# Altium project S12642_0404_4.PrjPcb
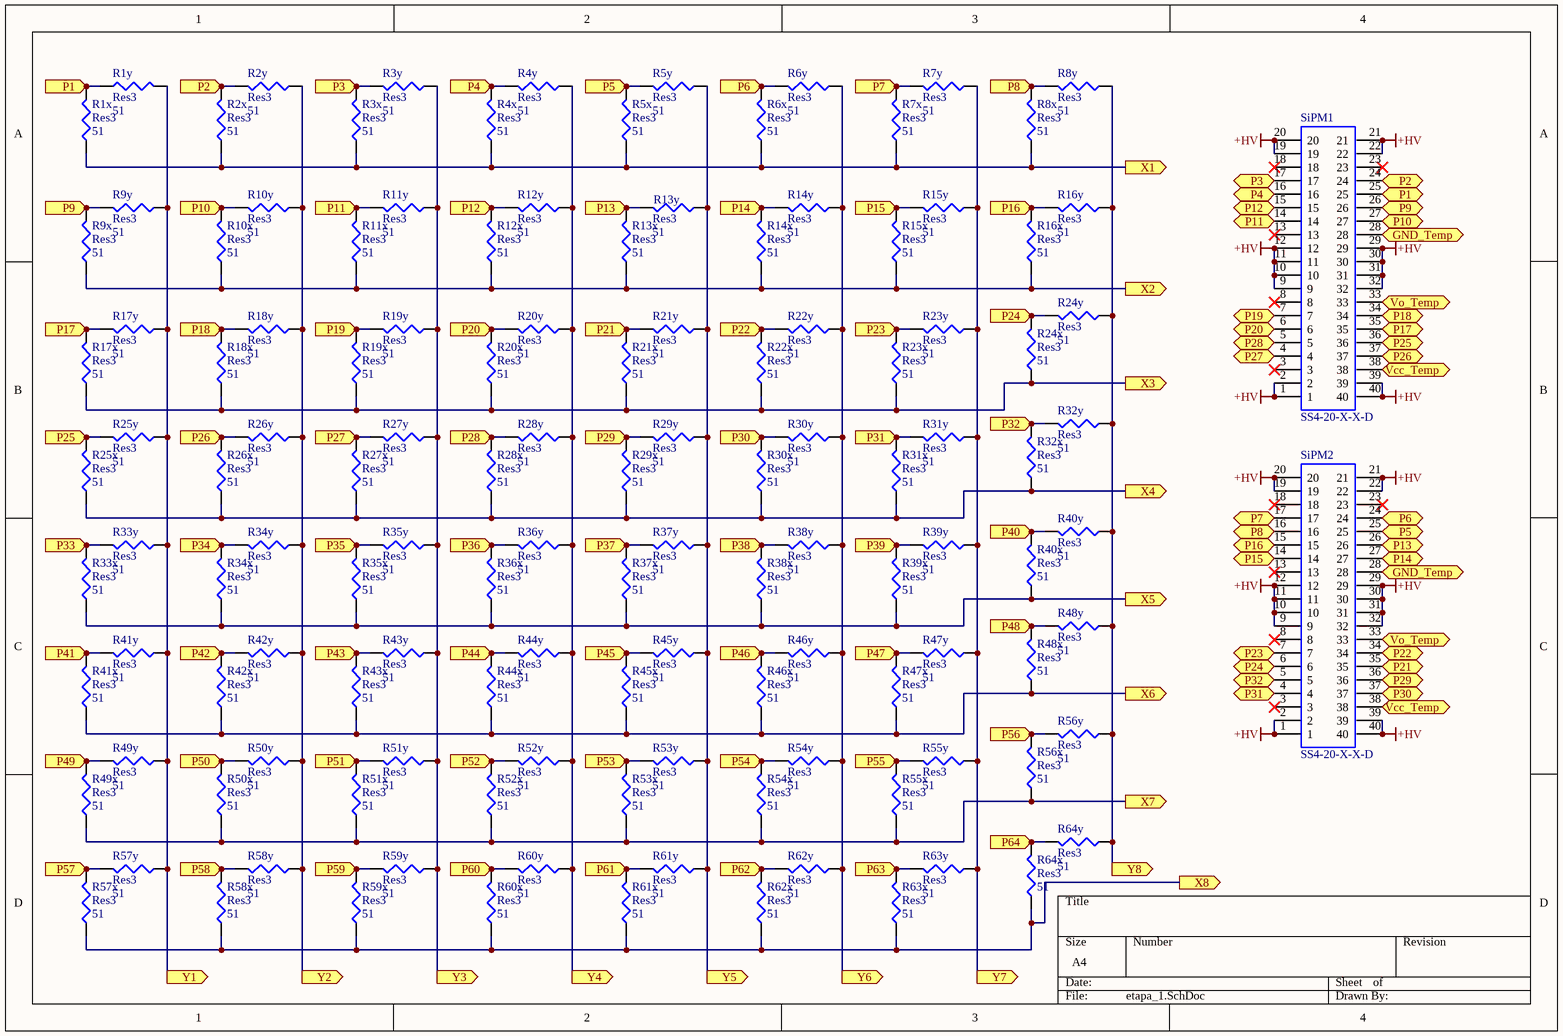
[diagram p0: etapa_1.SchDoc]
5 sheets, 421 parts. Net scope: flat (ports and power ports of the same name join across sheets).
Board file: etapa_1.PcbDoc
Sheets:
  etapa_1.SchDoc
  etapa_1_2.SchDoc
  etapa1_suma.SchDoc
  etapa1_anger_X.SchDoc
  etapa1_anger_Y.SchDoc

## Sheet etapa_1.SchDoc
size A4

### Parts
R1x  Res3  value 51  [0402]
R1y  Res3  value 51  [0402]
R2x  Res3  value 51  [0402]
R2y  Res3  value 51  [0402]
R3x  Res3  value 51  [0402]
R3y  Res3  value 51  [0402]
R4x  Res3  value 51  [0402]
R4y  Res3  value 51  [0402]
R5x  Res3  value 51  [0402]
R5y  Res3  value 51  [0402]
R6x  Res3  value 51  [0402]
R6y  Res3  value 51  [0402]
R7x  Res3  value 51  [0402]
R7y  Res3  value 51  [0402]
R8x  Res3  value 51  [0402]
R8y  Res3  value 51  [0402]
R9x  Res3  value 51  [0402]
R9y  Res3  value 51  [0402]
R10x  Res3  value 51  [0402]
R10y  Res3  value 51  [0402]
R11x  Res3  value 51  [0402]
R11y  Res3  value 51  [0402]
R12x  Res3  value 51  [0402]
R12y  Res3  value 51  [0402]
R13x  Res3  value 51  [0402]
R13y  Res3  value 51  [0402]
R14x  Res3  value 51  [0402]
R14y  Res3  value 51  [0402]
R15x  Res3  value 51  [0402]
R15y  Res3  value 51  [0402]
R16x  Res3  value 51  [0402]
R16y  Res3  value 51  [0402]
R17x  Res3  value 51  [0402]
R17y  Res3  value 51  [0402]
R18x  Res3  value 51  [0402]
R18y  Res3  value 51  [0402]
R19x  Res3  value 51  [0402]
R19y  Res3  value 51  [0402]
R20x  Res3  value 51  [0402]
R20y  Res3  value 51  [0402]
R21x  Res3  value 51  [0402]
R21y  Res3  value 51  [0402]
R22x  Res3  value 51  [0402]
R22y  Res3  value 51  [0402]
R23x  Res3  value 51  [0402]
R23y  Res3  value 51  [0402]
R24x  Res3  value 51  [0402]
R24y  Res3  value 51  [0402]
R25x  Res3  value 51  [0402]
R25y  Res3  value 51  [0402]
R26x  Res3  value 51  [0402]
R26y  Res3  value 51  [0402]
R27x  Res3  value 51  [0402]
R27y  Res3  value 51  [0402]
R28x  Res3  value 51  [0402]
R28y  Res3  value 51  [0402]
R29x  Res3  value 51  [0402]
R29y  Res3  value 51  [0402]
R30x  Res3  value 51  [0402]
R30y  Res3  value 51  [0402]
R31x  Res3  value 51  [0402]
R31y  Res3  value 51  [0402]
R32x  Res3  value 51  [0402]
R32y  Res3  value 51  [0402]
R33x  Res3  value 51  [0402]
R33y  Res3  value 51  [0402]
R34x  Res3  value 51  [0402]
R34y  Res3  value 51  [0402]
R35x  Res3  value 51  [0402]
R35y  Res3  value 51  [0402]
R36x  Res3  value 51  [0402]
R36y  Res3  value 51  [0402]
R37x  Res3  value 51  [0402]
R37y  Res3  value 51  [0402]
R38x  Res3  value 51  [0402]
R38y  Res3  value 51  [0402]
R39x  Res3  value 51  [0402]
R39y  Res3  value 51  [0402]
R40x  Res3  value 51  [0402]
R40y  Res3  value 51  [0402]
R41x  Res3  value 51  [0402]
R41y  Res3  value 51  [0402]
R42x  Res3  value 51  [0402]
R42y  Res3  value 51  [0402]
R43x  Res3  value 51  [0402]
R43y  Res3  value 51  [0402]
R44x  Res3  value 51  [0402]
R44y  Res3  value 51  [0402]
R45x  Res3  value 51  [0402]
R45y  Res3  value 51  [0402]
R46x  Res3  value 51  [0402]
R46y  Res3  value 51  [0402]
R47x  Res3  value 51  [0402]
R47y  Res3  value 51  [0402]
R48x  Res3  value 51  [0402]
R48y  Res3  value 51  [0402]
R49x  Res3  value 51  [0402]
R49y  Res3  value 51  [0402]
R50x  Res3  value 51  [0402]
R50y  Res3  value 51  [0402]
R51x  Res3  value 51  [0402]
R51y  Res3  value 51  [0402]
R52x  Res3  value 51  [0402]
R52y  Res3  value 51  [0402]
R53x  Res3  value 51  [0402]
R53y  Res3  value 51  [0402]
R54x  Res3  value 51  [0402]
R54y  Res3  value 51  [0402]
R55x  Res3  value 51  [0402]
R55y  Res3  value 51  [0402]
R56x  Res3  value 51  [0402]
R56y  Res3  value 51  [0402]
R57x  Res3  value 51  [0402]
R57y  Res3  value 51  [0402]
R58x  Res3  value 51  [0402]
R58y  Res3  value 51  [0402]
R59x  Res3  value 51  [0402]
R59y  Res3  value 51  [0402]
R60x  Res3  value 51  [0402]
R60y  Res3  value 51  [0402]
R61x  Res3  value 51  [0402]
R61y  Res3  value 51  [0402]
R62x  Res3  value 51  [0402]
R62y  Res3  value 51  [0402]
R63x  Res3  value 51  [0402]
R63y  Res3  value 51  [0402]
R64x  Res3  value 51  [0402]
R64y  Res3  value 51  [0402]
SiPM1  SS4-20-X-X-D  [SS4-20-X-X-D]
SiPM2  SS4-20-X-X-D  [SS4-20-X-X-D]

### Ports
GND_Temp (out), P1 (in), P1 (out), P2 (in), P2 (out), P3 (in), P3 (out), P4 (in), P4 (out), P5 (in), P5 (out), P6 (in), P6 (out), P7 (in), P7 (out), P8 (in), P8 (out), P9 (in), P9 (out), P10 (in), P10 (out), P11 (in), P11 (out), P12 (in), P12 (out), P13 (in), P13 (out), P14 (in), P14 (out), P15 (in), P15 (out), P16 (in), P16 (out), P17 (in), P17 (out), P18 (in), P18 (out), P19 (in), P19 (out), P20 (in), P20 (out), P21 (in), P21 (out), P22 (in), P22 (out), P23 (in), P23 (out), P24 (in), P24 (out), P25 (in), P25 (out), P26 (in), P26 (out), P27 (in), P27 (out), P28 (in), P28 (out), P29 (in), P29 (out), P30 (in), P30 (out), P31 (in), P31 (out), P32 (in), P32 (out), P33 (in), P34 (in), P35 (in), P36 (in), P37 (in), P38 (in), P39 (in), P40 (in), P41 (in), P42 (in), P43 (in), P44 (in), P45 (in), P46 (in), P47 (in), P48 (in), P49 (in), P50 (in), P51 (in), P52 (in), P53 (in), P54 (in), P55 (in), P56 (in), P57 (in), P58 (in), P59 (in), P60 (in), P61 (in), P62 (in), P63 (in), P64 (in), Vcc_Temp (out), Vo_Temp (out), X1 (out), X2 (out), X3 (out), X4 (out), X5 (out), X6 (out), X7 (out), X8 (out), Y1 (out), Y2 (out), Y3 (out), Y4 (out), Y5 (out), Y6 (out), Y7 (out), Y8 (out)

### Nets
+HV: SiPM1.1 SiPM1.2 SiPM1.9 SiPM1.10 SiPM1.11 SiPM1.12 SiPM1.19 SiPM1.20 SiPM1.21 SiPM1.22 SiPM1.29 SiPM1.30 SiPM1.31 SiPM1.32 SiPM1.39 SiPM1.40 SiPM2.1 SiPM2.2 SiPM2.9 SiPM2.10 SiPM2.11 SiPM2.12 SiPM2.19 SiPM2.20 SiPM2.21 SiPM2.22 SiPM2.29 SiPM2.30 SiPM2.31 SiPM2.32 SiPM2.39 SiPM2.40
NetR1n_2: R1x.2 R1y.1 SiPM1.25 ; port P1
NetR1x_1: R1x.1 R2x.1 R3x.1 R4x.1 R5x.1 R6x.1 R7x.1 R8x.1 ; port X1
NetR1y_2: R1y.2 R9y.1 R17y.1 R25y.1 R33y.1 R41y.1 R49y.1 R57y.1 ; port Y1
NetR2_1: R9x.1 R10x.1 R11x.1 R12x.1 R13x.1 R14x.1 R15x.1 R16x.1 ; port X2
NetR2n_2: R2x.2 R2y.2 SiPM1.24 ; port P2
NetR2y_1: R2y.1 R10y.1 R18y.1 R26y.1 R34y.1 R42y.1 R50y.1 R58y.1 ; port Y2
NetR3_1: R17x.1 R18x.1 R19x.1 R20x.1 R21x.1 R22x.1 R23x.1 R24x.1 ; port X3
NetR3n_2: R3x.2 R3y.2 SiPM1.17 ; port P3
NetR3y_1: R3y.1 R11y.1 R19y.1 R27y.1 R35y.1 R43y.1 R51y.1 R59y.1 ; port Y3
NetR4_1: R25x.1 R26x.1 R27x.1 R28x.1 R29x.1 R30x.1 R31x.1 R32x.1 ; port X4
NetR4n_2: R4x.2 R4y.2 SiPM1.16 ; port P4
NetR4y_1: R4y.1 R12y.1 R20y.1 R28y.1 R36y.1 R44y.1 R52y.1 R60y.1 ; port Y4
NetR5_1: R33x.1 R34x.1 R35x.1 R36x.1 R37x.1 R38x.1 R39x.1 R40x.1 ; port X5
NetR5n_2: R5x.2 R5y.2 SiPM2.25 ; port P5
NetR5y_1: R5y.1 R13y.1 R21y.1 R29y.1 R37y.1 R45y.1 R53y.1 R61y.1 ; port Y5
NetR6_1: R41x.1 R42x.1 R43x.1 R44x.1 R45x.1 R46x.1 R47x.1 R48x.1 ; port X6
NetR6n_2: R6x.2 R6y.2 SiPM2.24 ; port P6
NetR6y_1: R6y.1 R14y.1 R22y.1 R30y.1 R38y.1 R46y.1 R54y.1 R62y.1 ; port Y6
NetR7_1: R49x.1 R50x.1 R51x.1 R52x.1 R53x.1 R54x.1 R55x.1 R56x.1 ; port X7
NetR7n_2: R7x.2 R7y.2 SiPM2.17 ; port P7
NetR7y_1: R7y.1 R15y.1 R23y.1 R31y.1 R39y.1 R47y.1 R55y.1 R63y.1 ; port Y7
NetR8_1: R57x.1 R58x.1 R59x.1 R60x.1 R61x.1 R62x.1 R63x.1 R64x.1 ; port X8
NetR8n_2: R8x.2 R8y.2 SiPM2.16 ; port P8
NetR8y_1: R8y.1 R16y.1 R24y.1 R32y.1 R40y.1 R48y.1 R56y.1 R64y.1 ; port Y8
NetR9n_2: R9x.2 R9y.2 SiPM1.26 ; port P9
NetR10n_2: R10x.2 R10y.2 SiPM1.27 ; port P10
NetR11n_2: R11x.2 R11y.2 SiPM1.14 ; port P11
NetR12n_2: R12x.2 R12y.2 SiPM1.15 ; port P12
NetR13n_2: R13x.2 R13y.2 SiPM2.26 ; port P13
NetR14n_2: R14x.2 R14y.2 SiPM2.27 ; port P14
NetR15n_2: R15x.2 R15y.2 SiPM2.14 ; port P15
NetR16n_2: R16x.2 R16y.2 SiPM2.15 ; port P16
NetR17n_2: R17x.2 R17y.2 SiPM1.35 ; port P17
NetR18n_2: R18x.2 R18y.2 SiPM1.34 ; port P18
NetR19n_2: R19x.2 R19y.2 SiPM1.7 ; port P19
NetR20n_2: R20x.2 R20y.2 SiPM1.6 ; port P20
NetR21n_2: R21x.2 R21y.2 SiPM2.35 ; port P21
NetR22n_2: R22x.2 R22y.2 SiPM2.34 ; port P22
NetR23n_2: R23x.2 R23y.2 SiPM2.7 ; port P23
NetR24n_2: R24x.2 R24y.2 SiPM2.6 ; port P24
NetR25n_2: R25x.2 R25y.2 SiPM1.36 ; port P25
NetR26n_2: R26x.2 R26y.2 SiPM1.37 ; port P26
NetR27n_2: R27x.2 R27y.2 SiPM1.4 ; port P27
NetR28n_2: R28x.2 R28y.2 SiPM1.5 ; port P28
NetR29n_2: R29x.2 R29y.2 SiPM2.36 ; port P29
NetR30n_2: R30x.2 R30y.2 SiPM2.37 ; port P30
NetR31n_2: R31x.2 R31y.2 SiPM2.4 ; port P31
NetR32n_2: R32x.2 R32y.2 SiPM2.5 ; port P32
NetR33n_2: R33x.2 R33y.2 ; port P33
NetR34n_2: R34x.2 R34y.2 ; port P34
NetR35n_2: R35x.2 R35y.2 ; port P35
NetR36n_2: R36x.2 R36y.2 ; port P36
NetR37n_2: R37x.2 R37y.2 ; port P37
NetR38n_2: R38x.2 R38y.2 ; port P38
NetR39n_2: R39x.2 R39y.2 ; port P39
NetR40n_2: R40x.2 R40y.2 ; port P40
NetR41n_2: R41x.2 R41y.2 ; port P41
NetR42n_2: R42x.2 R42y.2 ; port P42
NetR43n_2: R43x.2 R43y.2 ; port P43
NetR44n_2: R44x.2 R44y.2 ; port P44
NetR45n_2: R45x.2 R45y.2 ; port P45
NetR46n_2: R46x.2 R46y.2 ; port P46
NetR47n_2: R47x.2 R47y.2 ; port P47
NetR48n_2: R48x.2 R48y.2 ; port P48
NetR49n_2: R49x.2 R49y.2 ; port P49
NetR50n_2: R50x.2 R50y.2 ; port P50
NetR51n_2: R51x.2 R51y.2 ; port P51
NetR52n_2: R52x.2 R52y.2 ; port P52
NetR53n_2: R53x.2 R53y.2 ; port P53
NetR54n_2: R54x.2 R54y.2 ; port P54
NetR55n_2: R55x.2 R55y.2 ; port P55
NetR56n_2: R56x.2 R56y.2 ; port P56
NetR57n_2: R57x.2 R57y.2 ; port P57
NetR58n_2: R58x.2 R58y.2 ; port P58
NetR59n_2: R59x.2 R59y.2 ; port P59
NetR60n_2: R60x.2 R60y.2 ; port P60
NetR61n_2: R61x.2 R61y.2 ; port P61
NetR62n_2: R62x.2 R62y.2 ; port P62
NetR63n_2: R63x.2 R63y.2 ; port P63
NetR64n_2: R64x.2 R64y.2 ; port P64
NetSiPM1_28: SiPM1.28 SiPM2.28 ; port GND_Temp
NetSiPM1_33: SiPM1.33 SiPM2.33 ; port Vo_Temp
NetSiPM1_38: SiPM1.38 SiPM2.38 ; port Vcc_Temp

Not connected (* = marked no-connect by the designer): SiPM1 3* 8* 13* 18* 23*; SiPM2 3* 8* 13* 18* 23*

### Library data of the parts
R1x R1y R2x R2y R3x R3y R4x R4y R5x R5y R6x R6y R7x R7y R8x R8y R9x R9y R10x R10y R11x R11y R12x R12y R13x R13y R14x R14y R15x R15y R16x R16y R17x R17y R18x R18y R19x R19y R20x R20y R21x R21y R22x R22y R23x R23y R24x R24y R25x R25y R26x R26y R27x R27y R28x R28y R29x R29y R30x R30y R31x R31y R32x R32y R33x R33y R34x R34y R35x R35y R36x R36y R37x R37y R38x R38y R39x R39y R40x R40y R41x R41y R42x R42y R43x R43y R44x R44y R45x R45y R46x R46y R47x R47y R48x R48y R49x R49y R50x R50y R51x R51y R52x R52y R53x R53y R54x R54y R55x R55y R56x R56y R57x R57y R58x R58y R59x R59y R60x R60y R61x R61y R62x R62y R63x R63y R64x R64y = Res3: Resistor; Published: 8-Jun-2000; LatestRevisionDate: 29-May-2009; LatestRevisionNote: IPC-7351 Footprint Added.; PackageReference: J1-0603; Publisher: Altium Limited; PackageDescription: Chip Resistor

## Sheet etapa_1_2.SchDoc
size A4
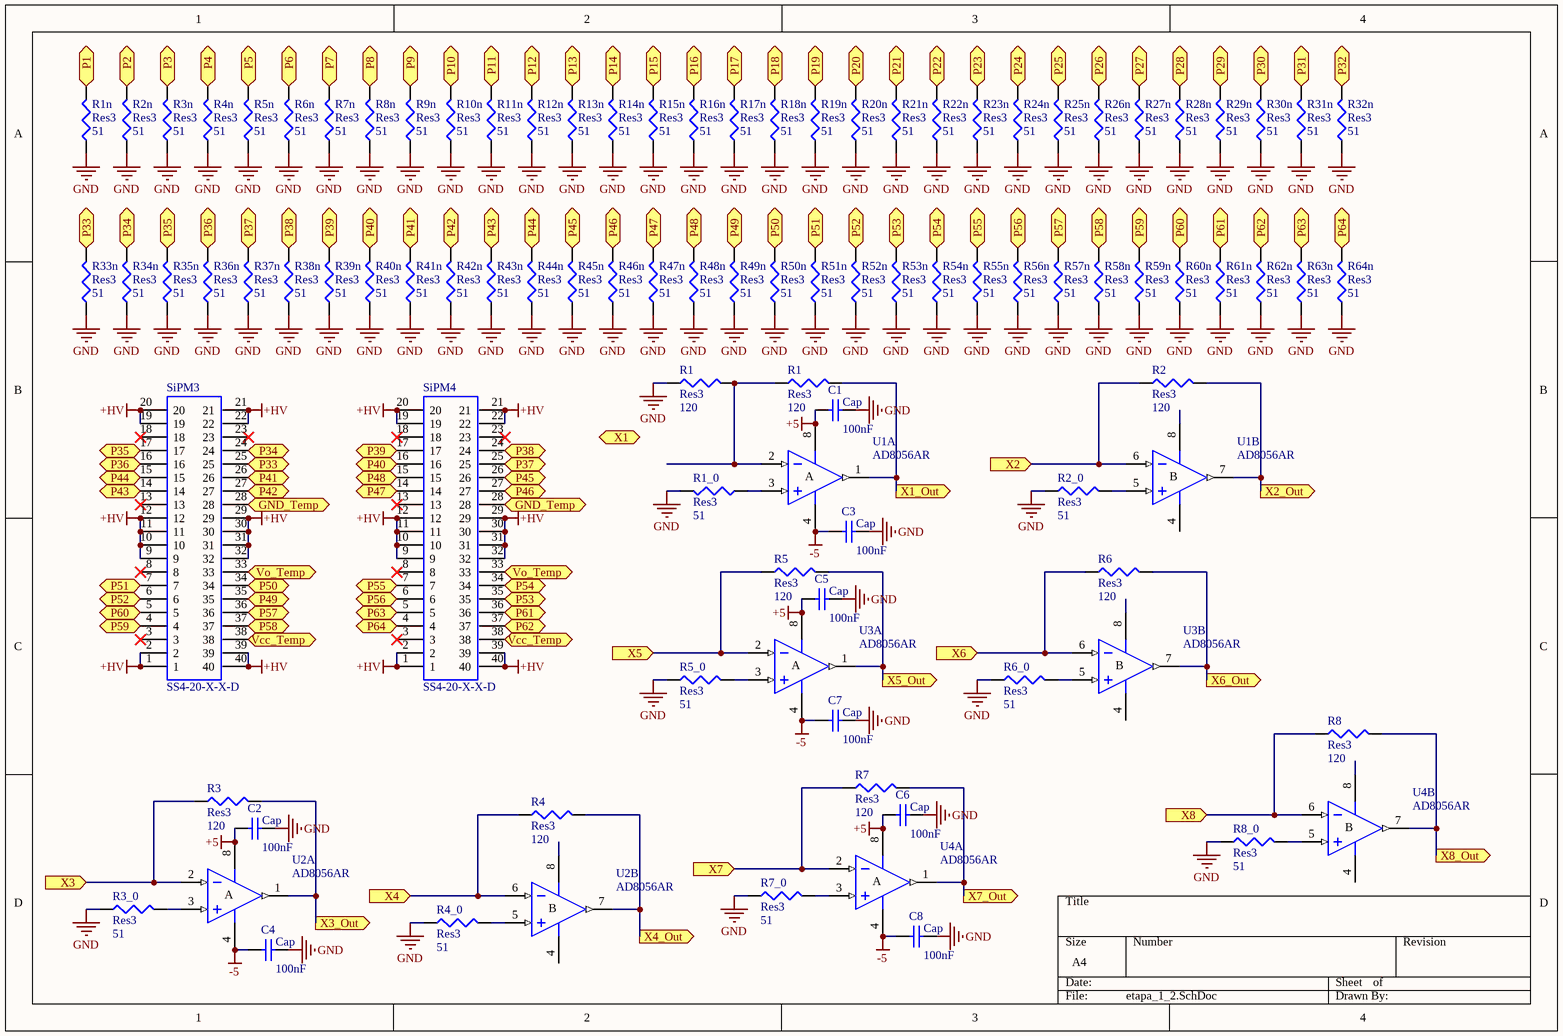
[diagram p1: etapa_1_2.SchDoc]

### Parts
(Parts that share a designator on the sheet are numbered #1, #2 ... from top to bottom, then left to right.)
C1  Cap  value 100nF  [1608[0603]]
C2  Cap  value 100nF  [1608[0603]]
C3  Cap  value 100nF  [1608[0603]]
C4  Cap  value 100nF  [1608[0603]]
C5  Cap  value 100nF  [1608[0603]]
C6  Cap  value 100nF  [1608[0603]]
C7  Cap  value 100nF  [1608[0603]]
C8  Cap  value 100nF  [1608[0603]]
R1#1  Res3  value 120  [0402]
R1#2  Res3  value 120  [0402]
R1_0  Res3  value 51  [0402]
R1n  Res3  value 51  [0402]
R2  Res3  value 120  [0402]
R2_0  Res3  value 51  [0402]
R2n  Res3  value 51  [0402]
R3  Res3  value 120  [0402]
R3_0  Res3  value 51  [0402]
R3n  Res3  value 51  [0402]
R4  Res3  value 120  [0402]
R4_0  Res3  value 51  [0402]
R4n  Res3  value 51  [0402]
R5  Res3  value 120  [0402]
R5_0  Res3  value 51  [0402]
R5n  Res3  value 51  [0402]
R6  Res3  value 120  [0402]
R6_0  Res3  value 51  [0402]
R6n  Res3  value 51  [0402]
R7  Res3  value 120  [0402]
R7_0  Res3  value 51  [0402]
R7n  Res3  value 51  [0402]
R8  Res3  value 120  [0402]
R8_0  Res3  value 51  [0402]
R8n  Res3  value 51  [0402]
R9n  Res3  value 51  [0402]
R10n  Res3  value 51  [0402]
R11n  Res3  value 51  [0402]
R12n  Res3  value 51  [0402]
R13n  Res3  value 51  [0402]
R14n  Res3  value 51  [0402]
R15n  Res3  value 51  [0402]
R16n  Res3  value 51  [0402]
R17n  Res3  value 51  [0402]
R18n  Res3  value 51  [0402]
R19n  Res3  value 51  [0402]
R20n  Res3  value 51  [0402]
R21n  Res3  value 51  [0402]
R22n  Res3  value 51  [0402]
R23n  Res3  value 51  [0402]
R24n  Res3  value 51  [0402]
R25n  Res3  value 51  [0402]
R26n  Res3  value 51  [0402]
R27n  Res3  value 51  [0402]
R28n  Res3  value 51  [0402]
R29n  Res3  value 51  [0402]
R30n  Res3  value 51  [0402]
R31n  Res3  value 51  [0402]
R32n  Res3  value 51  [0402]
R33n  Res3  value 51  [0402]
R34n  Res3  value 51  [0402]
R35n  Res3  value 51  [0402]
R36n  Res3  value 51  [0402]
R37n  Res3  value 51  [0402]
R38n  Res3  value 51  [0402]
R39n  Res3  value 51  [0402]
R40n  Res3  value 51  [0402]
R41n  Res3  value 51  [0402]
R42n  Res3  value 51  [0402]
R43n  Res3  value 51  [0402]
R44n  Res3  value 51  [0402]
R45n  Res3  value 51  [0402]
R46n  Res3  value 51  [0402]
R47n  Res3  value 51  [0402]
R48n  Res3  value 51  [0402]
R49n  Res3  value 51  [0402]
R50n  Res3  value 51  [0402]
R51n  Res3  value 51  [0402]
R52n  Res3  value 51  [0402]
R53n  Res3  value 51  [0402]
R54n  Res3  value 51  [0402]
R55n  Res3  value 51  [0402]
R56n  Res3  value 51  [0402]
R57n  Res3  value 51  [0402]
R58n  Res3  value 51  [0402]
R59n  Res3  value 51  [0402]
R60n  Res3  value 51  [0402]
R61n  Res3  value 51  [0402]
R62n  Res3  value 51  [0402]
R63n  Res3  value 51  [0402]
R64n  Res3  value 51  [0402]
SiPM3  SS4-20-X-X-D  [SS4-20-X-X-D]
SiPM4  SS4-20-X-X-D  [SS4-20-X-X-D]
U1  AD8056AR  [RM-8]  (parts A,B of 2)
U2  AD8056AR  [RM-8]  (parts A,B of 2)
U3  AD8056AR  [RM-8]  (parts A,B of 2)
U4  AD8056AR  [RM-8]  (parts A,B of 2)

### Ports
GND_Temp (out), P1 (in), P2 (in), P3 (in), P4 (in), P5 (in), P6 (in), P7 (in), P8 (in), P9 (in), P10 (in), P11 (in), P12 (in), P13 (in), P14 (in), P15 (in), P16 (in), P17 (in), P18 (in), P19 (in), P20 (in), P21 (in), P22 (in), P23 (in), P24 (in), P25 (in), P26 (in), P27 (in), P28 (in), P29 (in), P30 (in), P31 (in), P32 (in), P33 (in), P33 (out), P34 (in), P34 (out), P35 (in), P35 (out), P36 (in), P36 (out), P37 (in), P37 (out), P38 (in), P38 (out), P39 (in), P39 (out), P40 (in), P40 (out), P41 (in), P41 (out), P42 (in), P42 (out), P43 (in), P43 (out), P44 (in), P44 (out), P45 (in), P45 (out), P46 (in), P46 (out), P47 (in), P47 (out), P48 (in), P48 (out), P49 (in), P49 (out), P50 (in), P50 (out), P51 (in), P51 (out), P52 (in), P52 (out), P53 (in), P53 (out), P54 (in), P54 (out), P55 (in), P55 (out), P56 (in), P56 (out), P57 (in), P57 (out), P58 (in), P58 (out), P59 (in), P59 (out), P60 (in), P60 (out), P61 (in), P61 (out), P62 (in), P62 (out), P63 (in), P63 (out), P64 (in), P64 (out), Vcc_Temp (out), Vo_Temp (out), X1 (in), X1_Out (out), X2 (in), X2_Out (out), X3 (in), X3_Out (out), X4 (in), X4_Out (out), X5 (in), X5_Out (out), X6 (in), X6_Out (out), X7 (in), X7_Out (out), X8 (in), X8_Out (out)

### Nets
+5: C1.2 C2.2 C5.2 C6.2 U1.8(V+) U2.8(V+) U3.8(V+) U4.8(V+)
+HV: SiPM3.1 SiPM3.2 SiPM3.9 SiPM3.10 SiPM3.11 SiPM3.12 SiPM3.19 SiPM3.20 SiPM3.21 SiPM3.22 SiPM3.29 SiPM3.30 SiPM3.31 SiPM3.32 SiPM3.39 SiPM3.40 SiPM4.1 SiPM4.2 SiPM4.9 SiPM4.10 SiPM4.11 SiPM4.12 SiPM4.19 SiPM4.20 SiPM4.21 SiPM4.22 SiPM4.29 SiPM4.30 SiPM4.31 SiPM4.32 SiPM4.39 SiPM4.40
-5: C3.2 C4.2 C7.2 C8.2 U1.4(V-) U2.4(V-) U3.4(V-) U4.4(V-)
GND: C1.1 C2.1 C3.1 C4.1 C5.1 C6.1 C7.1 C8.1 R1#1.1 R1_0.2 R1n.1 R2_0.1 R2n.1 R3_0.1 R3n.1 R4_0.1 R4n.1 R5_0.1 R5n.1 R6_0.1 R6n.1 R7_0.1 R7n.1 R8_0.1 R8n.1 R9n.1 R10n.1 R11n.1 R12n.1 R13n.1 R14n.1 R15n.1 R16n.1 R17n.1 R18n.1 R19n.1 R20n.1 R21n.1 R22n.1 R23n.1 R24n.1 R25n.1 R26n.1 R27n.1 R28n.1 R29n.1 R30n.1 R31n.1 R32n.1 R33n.1 R34n.1 R35n.1 R36n.1 R37n.1 R38n.1 R39n.1 R40n.1 R41n.1 R42n.1 R43n.1 R44n.1 R45n.1 R46n.1 R47n.1 R48n.1 R49n.1 R50n.1 R51n.1 R52n.1 R53n.1 R54n.1 R55n.1 R56n.1 R57n.1 R58n.1 R59n.1 R60n.1 R61n.1 R62n.1 R63n.1 R64n.1
NetC1x_1: R1#2.2 U1.1(OUT) ; port X1_Out
NetC2x_1: R2.2 U1.7(OUT) ; port X2_Out
NetC3x_1: R3.2 U2.1(OUT) ; port X3_Out
NetC4x_1: R4.2 U2.7(OUT) ; port X4_Out
NetC5x_1: R5.2 U3.1(OUT) ; port X5_Out
NetC6x_1: R6.2 U3.7(OUT) ; port X6_Out
NetC7x_1: R7.2 U4.1(OUT) ; port X7_Out
NetC8x_1: R8.2 U4.7(OUT) ; port X8_Out
NetR1#1_2: R1#1.2 R1#2.1 U1.2(IN-)
NetR1_0_1: R1_0.1 U1.3(IN+)
NetR1n_2: R1n.2 ; port P1
NetR2_0_2: R2_0.2 U1.5(IN+)
NetR2_1: R2.1 U1.6(IN-) ; port X2
NetR2n_2: R2n.2 ; port P2
NetR3_0_2: R3_0.2 U2.3(IN+)
NetR3_1: R3.1 U2.2(IN-) ; port X3
NetR3n_2: R3n.2 ; port P3
NetR4_0_2: R4_0.2 U2.5(IN+)
NetR4_1: R4.1 U2.6(IN-) ; port X4
NetR4n_2: R4n.2 ; port P4
NetR5_0_2: R5_0.2 U3.3(IN+)
NetR5_1: R5.1 U3.2(IN-) ; port X5
NetR5n_2: R5n.2 ; port P5
NetR6_0_2: R6_0.2 U3.5(IN+)
NetR6_1: R6.1 U3.6(IN-) ; port X6
NetR6n_2: R6n.2 ; port P6
NetR7_0_2: R7_0.2 U4.3(IN+)
NetR7_1: R7.1 U4.2(IN-) ; port X7
NetR7n_2: R7n.2 ; port P7
NetR8_0_2: R8_0.2 U4.5(IN+)
NetR8_1: R8.1 U4.6(IN-) ; port X8
NetR8n_2: R8n.2 ; port P8
NetR9n_2: R9n.2 ; port P9
NetR10n_2: R10n.2 ; port P10
NetR11n_2: R11n.2 ; port P11
NetR12n_2: R12n.2 ; port P12
NetR13n_2: R13n.2 ; port P13
NetR14n_2: R14n.2 ; port P14
NetR15n_2: R15n.2 ; port P15
NetR16n_2: R16n.2 ; port P16
NetR17n_2: R17n.2 ; port P17
NetR18n_2: R18n.2 ; port P18
NetR19n_2: R19n.2 ; port P19
NetR20n_2: R20n.2 ; port P20
NetR21n_2: R21n.2 ; port P21
NetR22n_2: R22n.2 ; port P22
NetR23n_2: R23n.2 ; port P23
NetR24n_2: R24n.2 ; port P24
NetR25n_2: R25n.2 ; port P25
NetR26n_2: R26n.2 ; port P26
NetR27n_2: R27n.2 ; port P27
NetR28n_2: R28n.2 ; port P28
NetR29n_2: R29n.2 ; port P29
NetR30n_2: R30n.2 ; port P30
NetR31n_2: R31n.2 ; port P31
NetR32n_2: R32n.2 ; port P32
NetR33n_2: R33n.2 SiPM3.25 ; port P33
NetR34n_2: R34n.2 SiPM3.24 ; port P34
NetR35n_2: R35n.2 SiPM3.17 ; port P35
NetR36n_2: R36n.2 SiPM3.16 ; port P36
NetR37n_2: R37n.2 SiPM4.25 ; port P37
NetR38n_2: R38n.2 SiPM4.24 ; port P38
NetR39n_2: R39n.2 SiPM4.17 ; port P39
NetR40n_2: R40n.2 SiPM4.16 ; port P40
NetR41n_2: R41n.2 SiPM3.26 ; port P41
NetR42n_2: R42n.2 SiPM3.27 ; port P42
NetR43n_2: R43n.2 SiPM3.14 ; port P43
NetR44n_2: R44n.2 SiPM3.15 ; port P44
NetR45n_2: R45n.2 SiPM4.26 ; port P45
NetR46n_2: R46n.2 SiPM4.27 ; port P46
NetR47n_2: R47n.2 SiPM4.14 ; port P47
NetR48n_2: R48n.2 SiPM4.15 ; port P48
NetR49n_2: R49n.2 SiPM3.35 ; port P49
NetR50n_2: R50n.2 SiPM3.34 ; port P50
NetR51n_2: R51n.2 SiPM3.7 ; port P51
NetR52n_2: R52n.2 SiPM3.6 ; port P52
NetR53n_2: R53n.2 SiPM4.35 ; port P53
NetR54n_2: R54n.2 SiPM4.34 ; port P54
NetR55n_2: R55n.2 SiPM4.7 ; port P55
NetR56n_2: R56n.2 SiPM4.6 ; port P56
NetR57n_2: R57n.2 SiPM3.36 ; port P57
NetR58n_2: R58n.2 SiPM3.37 ; port P58
NetR59n_2: R59n.2 SiPM3.4 ; port P59
NetR60n_2: R60n.2 SiPM3.5 ; port P60
NetR61n_2: R61n.2 SiPM4.36 ; port P61
NetR62n_2: R62n.2 SiPM4.37 ; port P62
NetR63n_2: R63n.2 SiPM4.5 ; port P63
NetR64n_2: R64n.2 SiPM4.4 ; port P64
NetSiPM1_28: SiPM3.28 SiPM4.28 ; port GND_Temp
NetSiPM1_33: SiPM3.33 SiPM4.33 ; port Vo_Temp
NetSiPM1_38: SiPM3.38 SiPM4.38 ; port Vcc_Temp

Not connected (* = marked no-connect by the designer): SiPM3 3* 8* 13* 18* 23*; SiPM4 3* 8* 13* 18* 23*

### Notes on the sheet
- (in symbol AD8056AR, part A) A
- (in symbol AD8056AR, part B) B

### Library data of the parts
C1-C8 = Cap: Capacitor; Published: 8-Jun-2000; LatestRevisionDate: 17-Jul-2002; LatestRevisionNote: Re-released for DXP Platform.; PackageReference: RAD-0.3; Publisher: Altium Limited; PackageDescription: Radial Cap, Thru-Hole; 2 Leads; 0.3 in Pin Spacing
R1#1 R1#2 R1_0 R1n R2 R2_0 R2n R3 R3_0 R3n R4 R4_0 R4n R5 R5_0 R5n R6 R6_0 R6n R7 R7_0 R7n R8 R8_0 R8n R9n R10n R11n R12n R13n R14n R15n R16n R17n R18n R19n R20n R21n R22n R23n R24n R25n R26n R27n R28n R29n R30n R31n R32n R33n R34n R35n R36n R37n R38n R39n R40n R41n R42n R43n R44n R45n R46n R47n R48n R49n R50n R51n R52n R53n R54n R55n R56n R57n R58n R59n R60n R61n R62n R63n R64n = Res3: Resistor; Published: 8-Jun-2000; LatestRevisionDate: 29-May-2009; LatestRevisionNote: IPC-7351 Footprint Added.; PackageReference: J1-0603; Publisher: Altium Limited; PackageDescription: Chip Resistor
U1-U4 = AD8056AR: Low Cost, 300MHz Voltage Feedback Amplifier; Published: 8-Jun-2000; LatestRevisionDate: 13-Apr-2006; LatestRevisionNote: IPC-7351 Footprint Added.; DatasheetVersion: REV. 0 1997; PackageVersion: revA; PackageReference: SO-8; Publisher: Altium Limited; PackageDescription: 8-Pin Small Outline Integrated Circuit 1.27 mm Pitch; Code_JEDEC: MS-012-AA; Code_IPC: SOIC127P600-8; ComponentLink1Description: Manufacturer Link; ComponentLink1URL: http://www.analog.com/en/prod/0,,759_786_AD8055%2C00.html; ComponentLink2Description: Datasheet; ComponentLink2URL: http://www.analog.com/UploadedFiles/Data_Sheets/40402558757264AD8055_6_i.pdf

## Sheet etapa1_suma.SchDoc
size A4
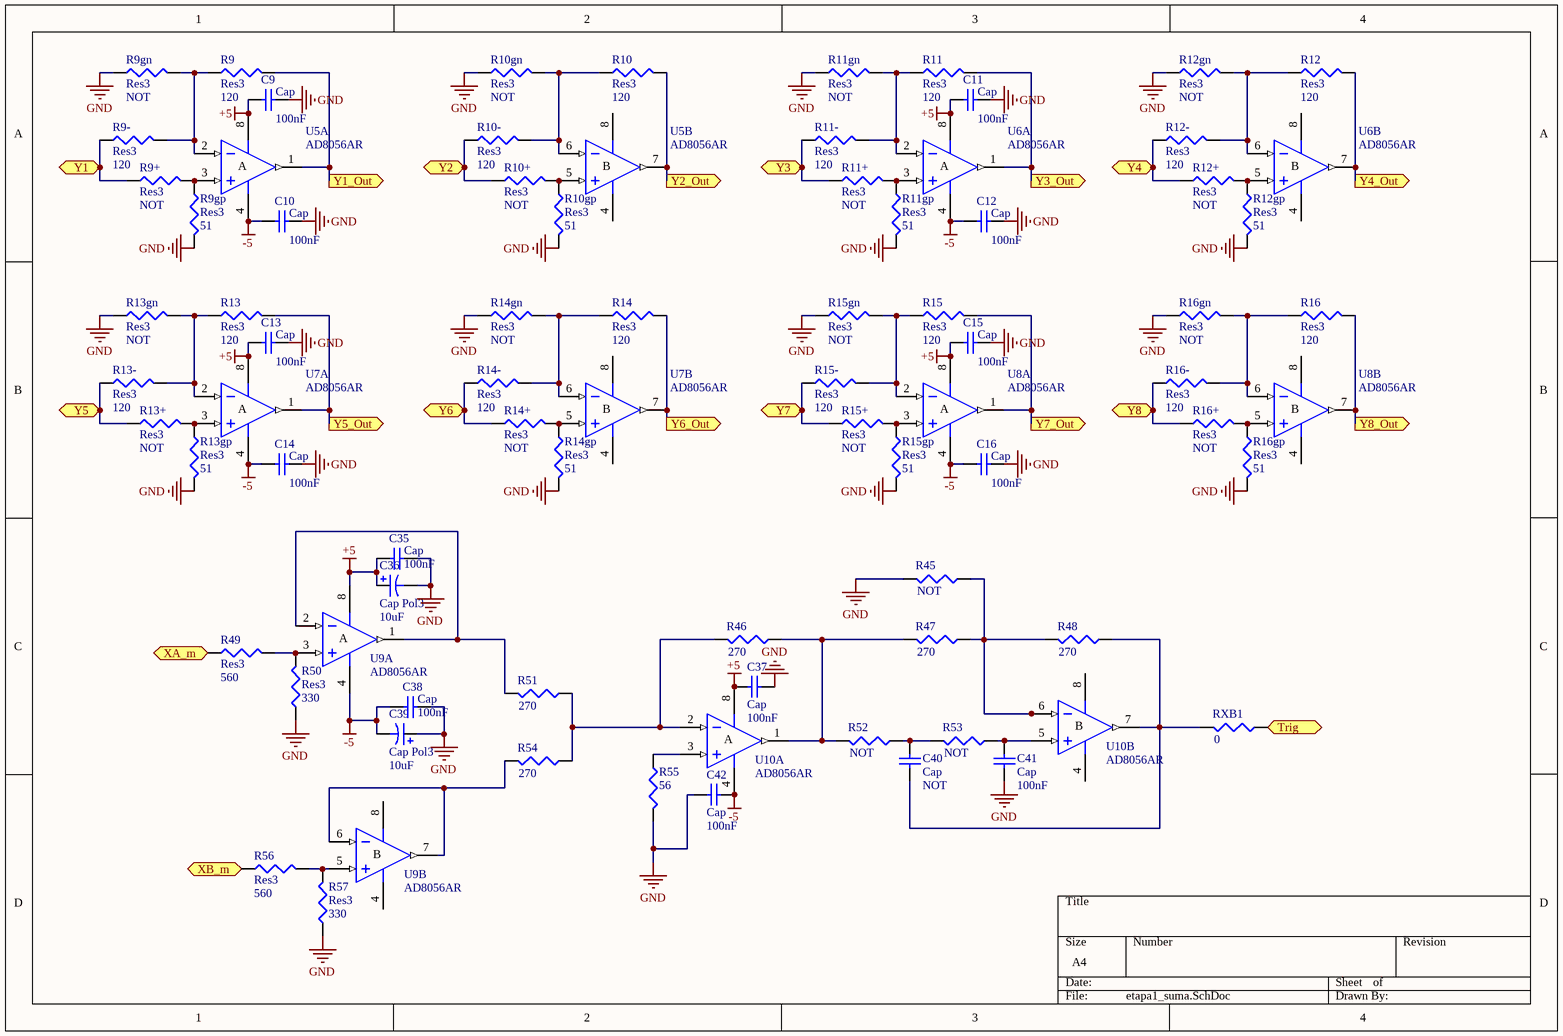
[diagram p2: etapa1_suma.SchDoc]

### Parts
C9  Cap  value 100nF  [1608[0603]]
C10  Cap  value 100nF  [1608[0603]]
C11  Cap  value 100nF  [1608[0603]]
C12  Cap  value 100nF  [1608[0603]]
C13  Cap  value 100nF  [1608[0603]]
C14  Cap  value 100nF  [1608[0603]]
C15  Cap  value 100nF  [1608[0603]]
C16  Cap  value 100nF  [1608[0603]]
C35  Cap  value 100nF  [6-0805_N]
C36  Cap Pol3  value 10uF  [6-0805_N]
C37  Cap  value 100nF  [1608[0603]]
C38  Cap  value 100nF  [6-0805_N]
C39  Cap Pol3  value 10uF  [6-0805_N]
C40  Cap  value NOT  [1608[0603]]
C41  Cap  value 100nF  [1608[0603]]
C42  Cap  value 100nF  [1608[0603]]
R9  Res3  value 120  [0402]
R9+  Res3  value NOT  [0402]
R9-  Res3  value 120  [0402]
R9gn  Res3  value NOT  [0402]
R9gp  Res3  value 51  [0402]
R10  Res3  value 120  [0402]
R10+  Res3  value NOT  [0402]
R10-  Res3  value 120  [0402]
R10gn  Res3  value NOT  [0402]
R10gp  Res3  value 51  [0402]
R11  Res3  value 120  [0402]
R11+  Res3  value NOT  [0402]
R11-  Res3  value 120  [0402]
R11gn  Res3  value NOT  [0402]
R11gp  Res3  value 51  [0402]
R12  Res3  value 120  [0402]
R12+  Res3  value NOT  [0402]
R12-  Res3  value 120  [0402]
R12gn  Res3  value NOT  [0402]
R12gp  Res3  value 51  [0402]
R13  Res3  value 120  [0402]
R13+  Res3  value NOT  [0402]
R13-  Res3  value 120  [0402]
R13gn  Res3  value NOT  [0402]
R13gp  Res3  value 51  [0402]
R14  Res3  value 120  [0402]
R14+  Res3  value NOT  [0402]
R14-  Res3  value 120  [0402]
R14gn  Res3  value NOT  [0402]
R14gp  Res3  value 51  [0402]
R15  Res3  value 120  [0402]
R15+  Res3  value NOT  [0402]
R15-  Res3  value 120  [0402]
R15gn  Res3  value NOT  [0402]
R15gp  Res3  value 51  [0402]
R16  Res3  value 120  [0402]
R16+  Res3  value NOT  [0402]
R16-  Res3  value 120  [0402]
R16gn  Res3  value NOT  [0402]
R16gp  Res3  value 51  [0402]
R45  value NOT  [J1-0603]  (hidden comment: Res3)
R46  value 270  [J1-0603]  (hidden comment: Res3)
R47  value 270  [J1-0603]  (hidden comment: Res3)
R48  value 270  [J1-0603]  (hidden comment: Res3)
R49  Res3  value 560  [J1-0603]
R50  Res3  value 330  [J1-0603]
R51  value 270  [J1-0603]  (hidden comment: Res3)
R52  value NOT  [J1-0603]  (hidden comment: Res3)
R53  value NOT  [J1-0603]  (hidden comment: Res3)
R54  value 270  [J1-0603]  (hidden comment: Res3)
R55  value 56  [J1-0603]  (hidden comment: Res3)
R56  Res3  value 560  [J1-0603]
R57  Res3  value 330  [J1-0603]
RXB1  value 0  [J1-0603]  (hidden comment: Res3)
U5  AD8056AR  [RM-8]  (parts A,B of 2)
U6  AD8056AR  [RM-8]  (parts A,B of 2)
U7  AD8056AR  [RM-8]  (parts A,B of 2)
U8  AD8056AR  [RM-8]  (parts A,B of 2)
U9  AD8056AR  [RM-8]  (parts A,B of 2)
U10  AD8056AR  [RM-8]  (parts A,B of 2)

### Ports
Trig (out), XA_m (out), XB_m (out), Y1 (in), Y1_Out (out), Y2 (in), Y2_Out (out), Y3 (in), Y3_Out (out), Y4 (in), Y4_Out (out), Y5 (in), Y5_Out (out), Y6 (in), Y6_Out (out), Y7 (in), Y7_Out (out), Y8 (in), Y8_Out (out)

### Nets
+5: C9.2 C11.2 C13.2 C15.2 C35.2 C36.1 C37.1 U5.8(V+) U6.8(V+) U7.8(V+) U8.8(V+) U9.8(V+) U10.8(V+)
-5: C10.2 C12.2 C14.2 C16.2 C38.2 C39.2 C42.2 U5.4(V-) U6.4(V-) U7.4(V-) U8.4(V-) U9.4(V-) U10.4(V-)
GND: C9.1 C10.1 C11.1 C12.1 C13.1 C14.1 C15.1 C16.1 C35.1 C36.2 C37.2 C38.1 C39.1 C41.2 C42.1 R9gn.1 R9gp.2 R10gn.1 R10gp.2 R11gn.1 R11gp.2 R12gn.1 R12gp.2 R13gn.1 R13gp.2 R14gn.1 R14gp.2 R15gn.1 R15gp.2 R16gn.1 R16gp.2 R45.2 R50.1 R55.2 R57.1
NetC1y_1: R9.2 U5.1(OUT) ; port Y1_Out
NetC2y_1: R10.2 U5.7(OUT) ; port Y2_Out
NetC3y_1: R11.2 U6.1(OUT) ; port Y3_Out
NetC4y_1: R12.2 U6.7(OUT) ; port Y4_Out
NetC5y_1: R13.2 U7.1(OUT) ; port Y5_Out
NetC6y_1: R14.2 U7.7(OUT) ; port Y6_Out
NetC7y_1: R15.2 U8.1(OUT) ; port Y7_Out
NetC8y_1: R16.2 U8.7(OUT) ; port Y8_Out
NetC18_2: R49.1 ; port XA_m
NetC24_2: R56.1 ; port XB_m
NetC40_1: C40.1 R52.1 R53.2
NetC40_2: C40.2 R48.1 RXB1.2 U10.7(OUT)
NetC41_1: C41.1 R53.1 U10.5(IN+)
NetR1y_2: R9+.1 R9-.1 ; port Y1
NetR2y_1: R10+.1 R10-.1 ; port Y2
NetR3y_1: R11+.1 R11-.1 ; port Y3
NetR4y_1: R12+.1 R12-.1 ; port Y4
NetR5y_1: R13+.1 R13-.1 ; port Y5
NetR6y_1: R14+.1 R14-.1 ; port Y6
NetR7y_1: R15+.1 R15-.1 ; port Y7
NetR8y_1: R16+.1 R16-.1 ; port Y8
NetR9+_2: R9+.2 R9gp.1 U5.3(IN+)
NetR9_1: R9.1 R9-.2 R9gn.2 U5.2(IN-)
NetR10+_2: R10+.2 R10gp.1 U5.5(IN+)
NetR10_1: R10.1 R10-.2 R10gn.2 U5.6(IN-)
NetR11+_2: R11+.2 R11gp.1 U6.3(IN+)
NetR11_1: R11.1 R11-.2 R11gn.2 U6.2(IN-)
NetR12+_2: R12+.2 R12gp.1 U6.5(IN+)
NetR12_1: R12.1 R12-.2 R12gn.2 U6.6(IN-)
NetR13+_2: R13+.2 R13gp.1 U7.3(IN+)
NetR13_1: R13.1 R13-.2 R13gn.2 U7.2(IN-)
NetR14+_2: R14+.2 R14gp.1 U7.5(IN+)
NetR14_1: R14.1 R14-.2 R14gn.2 U7.6(IN-)
NetR15+_2: R15+.2 R15gp.1 U8.3(IN+)
NetR15_1: R15.1 R15-.2 R15gn.2 U8.2(IN-)
NetR16+_2: R16+.2 R16gp.1 U8.5(IN+)
NetR16_1: R16.1 R16-.2 R16gn.2 U8.6(IN-)
NetR45_1: R45.1 R47.1 R48.2 U10.6(IN-)
NetR46_1: R46.1 R47.2 R52.2 U10.1(OUT)
NetR46_2: R46.2 R51.1 R54.1 U10.2(IN-)
NetR49_2: R49.2 R50.2 U9.3(IN+)
NetR51_2: R51.2 U9.1(OUT) U9.2(IN-)
NetR54_2: R54.2 U9.6(IN-) U9.7(OUT)
NetR55_1: R55.1 U10.3(IN+)
NetR56_2: R56.2 R57.2 U9.5(IN+)
NetRXB1_1: RXB1.1 ; port Trig

### Notes on the sheet
- (in symbol AD8056AR, part A) A
- (in symbol AD8056AR, part B) B

### Library data of the parts
C9-C16 C35 C37 C38 C40-C42 = Cap: Capacitor; Published: 8-Jun-2000; LatestRevisionDate: 17-Jul-2002; LatestRevisionNote: Re-released for DXP Platform.; PackageReference: RAD-0.3; Publisher: Altium Limited; PackageDescription: Radial Cap, Thru-Hole; 2 Leads; 0.3 in Pin Spacing
C36 C39 = Cap Pol3: Polarized Capacitor (Surface Mount); Published: 8-Jun-2000; LatestRevisionDate: 29-May-2009; LatestRevisionNote: IPC-7351 Footprint Added.; PackageReference: C0805; Publisher: Altium Limited; PackageDescription: Chip Capacitor
R9 R9+ R9- R9gn R9gp R10 R10+ R10- R10gn R10gp R11 R11+ R11- R11gn R11gp R12 R12+ R12- R12gn R12gp R13 R13+ R13- R13gn R13gp R14 R14+ R14- R14gn R14gp R15 R15+ R15- R15gn R15gp R16 R16+ R16- R16gn R16gp R45-R57 RXB1 = Res3: Resistor; Published: 8-Jun-2000; LatestRevisionDate: 29-May-2009; LatestRevisionNote: IPC-7351 Footprint Added.; PackageReference: J1-0603; Publisher: Altium Limited; PackageDescription: Chip Resistor
U5-U10 = AD8056AR: as U1 on sheet etapa_1_2; Published: 8-Jun-2000; LatestRevisionDate: 13-Apr-2006; LatestRevisionNote: IPC-7351 Footprint Added.; DatasheetVersion: REV. 0 1997; PackageVersion: revA; PackageReference: SO-8; Publisher: Altium Limited; PackageDescription: 8-Pin Small Outline Integrated Circuit 1.27 mm Pitch; Code_JEDEC: MS-012-AA; Code_IPC: SOIC127P600-8; ComponentLink1Description: Manufacturer Link; ComponentLink1URL: http://www.analog.com/en/prod/0,,759_786_AD8055%2C00.html; ComponentLink2Description: Datasheet; ComponentLink2URL: http://www.analog.com/UploadedFiles/Data_Sheets/40402558757264AD8055_6_i.pdf

## Sheet etapa1_anger_X.SchDoc
size A4
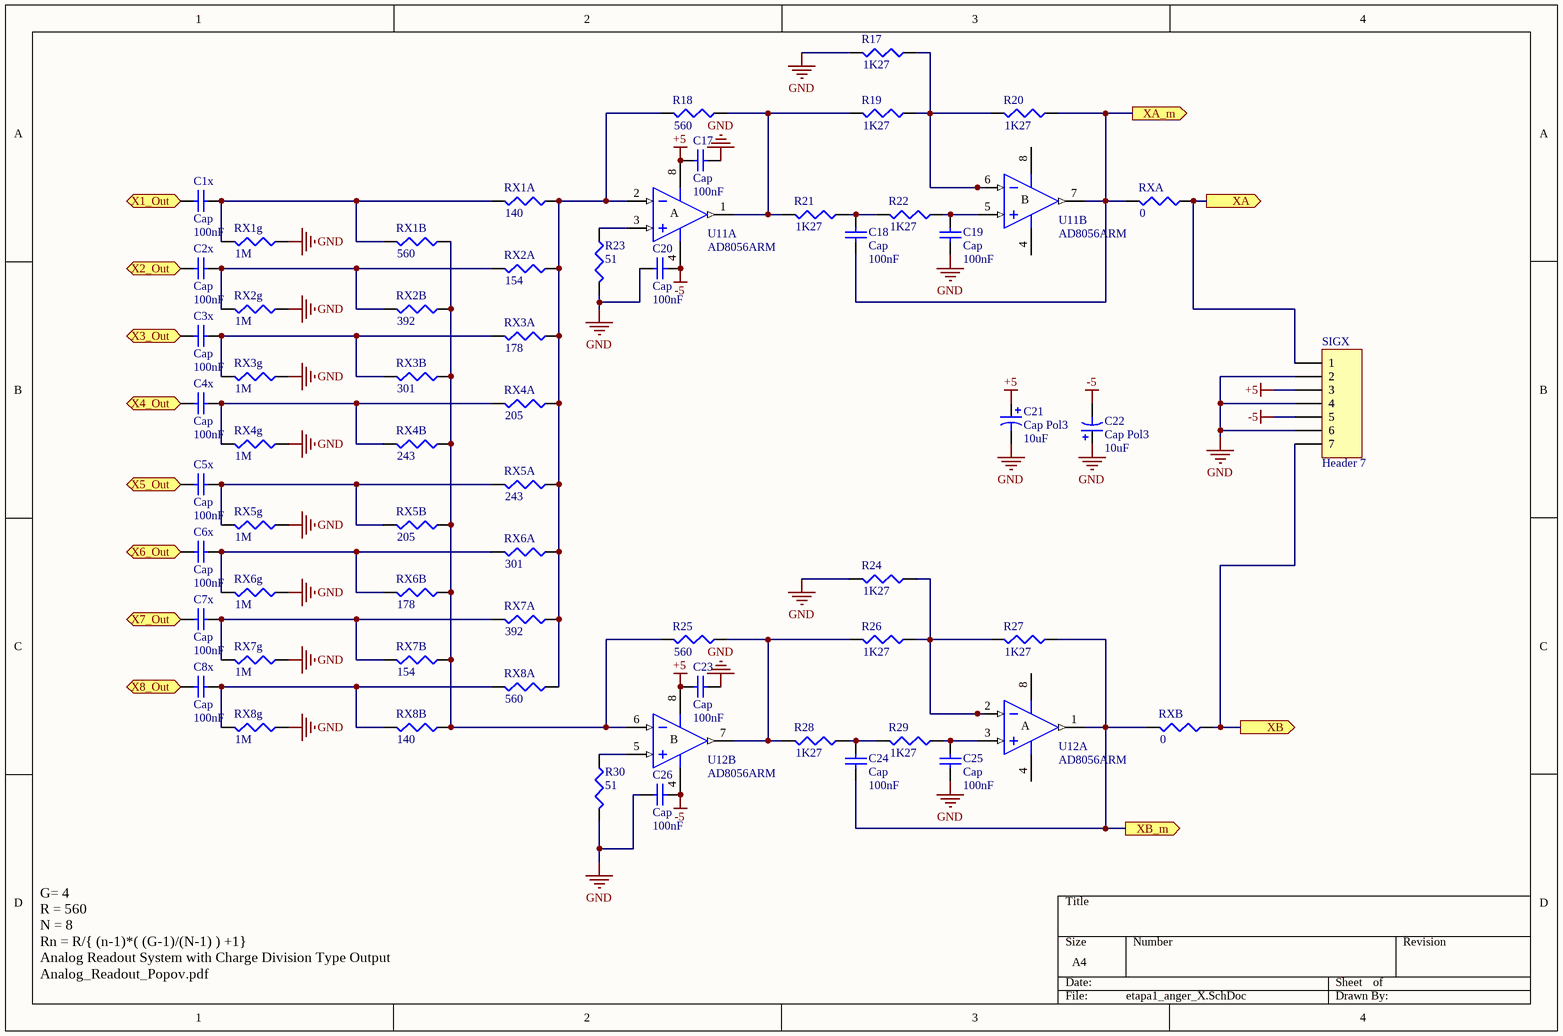
[diagram p3: etapa1_anger_X.SchDoc]

### Parts
C1x  Cap  value 100nF  [1608[0603]]
C2x  Cap  value 100nF  [1608[0603]]
C3x  Cap  value 100nF  [1608[0603]]
C4x  Cap  value 100nF  [1608[0603]]
C5x  Cap  value 100nF  [1608[0603]]
C6x  Cap  value 100nF  [1608[0603]]
C7x  Cap  value 100nF  [1608[0603]]
C8x  Cap  value 100nF  [1608[0603]]
C17  Cap  value 100nF  [1608[0603]]
C18  Cap  value 100nF  [1608[0603]]
C19  Cap  value 100nF  [1608[0603]]
C20  Cap  value 100nF  [1608[0603]]
C21  Cap Pol3  value 10uF  [C0805]
C22  Cap Pol3  value 10uF  [C0805]
C23  Cap  value 100nF  [1608[0603]]
C24  Cap  value 100nF  [1608[0603]]
C25  Cap  value 100nF  [1608[0603]]
C26  Cap  value 100nF  [1608[0603]]
R17  value 1K27  [1608[0603]]  (hidden comment: Res3)
R18  value 560  [0402]  (hidden comment: Res3)
R19  value 1K27  [0402]  (hidden comment: Res3)
R20  value 1K27  [0402]  (hidden comment: Res3)
R21  value 1K27  [0402]  (hidden comment: Res3)
R22  value 1K27  [0402]  (hidden comment: Res3)
R23  value 51  [0402]  (hidden comment: Res3)
R24  value 1K27  [1608[0603]]  (hidden comment: Res3)
R25  value 560  [0402]  (hidden comment: Res3)
R26  value 1K27  [0402]  (hidden comment: Res3)
R27  value 1K27  [0402]  (hidden comment: Res3)
R28  value 1K27  [0402]  (hidden comment: Res3)
R29  value 1K27  [0402]  (hidden comment: Res3)
R30  value 51  [0402]  (hidden comment: Res3)
RX1A  value 140  [0402]  (hidden comment: Res3)
RX1B  value 560  [0402]  (hidden comment: Res3)
RX1g  value 1M  [J1-0603]  (hidden comment: Res3)
RX2A  value 154  [0402]  (hidden comment: Res3)
RX2B  value 392  [0402]  (hidden comment: Res3)
RX2g  value 1M  [J1-0603]  (hidden comment: Res3)
RX3A  value 178  [0402]  (hidden comment: Res3)
RX3B  value 301  [0402]  (hidden comment: Res3)
RX3g  value 1M  [J1-0603]  (hidden comment: Res3)
RX4A  value 205  [0402]  (hidden comment: Res3)
RX4B  value 243  [0402]  (hidden comment: Res3)
RX4g  value 1M  [J1-0603]  (hidden comment: Res3)
RX5A  value 243  [0402]  (hidden comment: Res3)
RX5B  value 205  [0402]  (hidden comment: Res3)
RX5g  value 1M  [J1-0603]  (hidden comment: Res3)
RX6A  value 301  [0402]  (hidden comment: Res3)
RX6B  value 178  [0402]  (hidden comment: Res3)
RX6g  value 1M  [J1-0603]  (hidden comment: Res3)
RX7A  value 392  [0402]  (hidden comment: Res3)
RX7B  value 154  [0402]  (hidden comment: Res3)
RX7g  value 1M  [J1-0603]  (hidden comment: Res3)
RX8A  value 560  [0402]  (hidden comment: Res3)
RX8B  value 140  [0402]  (hidden comment: Res3)
RX8g  value 1M  [J1-0603]  (hidden comment: Res3)
RXA  value 0  [0402]  (hidden comment: Res3)
RXB  value 0  [0402]  (hidden comment: Res3)
SIGX  Header 7  [HDR1X7]
U11  AD8056ARM  [RM-8]  (parts A,B of 2)
U12  AD8056ARM  [RM-8]  (parts A,B of 2)

### Ports
X1_Out (out), X2_Out (out), X3_Out (out), X4_Out (out), X5_Out (out), X6_Out (out), X7_Out (out), X8_Out (out), XA (out), XA_m (out), XB (out), XB_m (out)

### Nets
+5: C17.1 C21.1 C23.1 SIGX.3 U11.8(V+) U12.8(V+)
-5: C20.2 C22.2 C26.2 SIGX.5 U11.4(V-) U12.4(V-)
GND: C17.2 C19.2 C20.1 C21.2 C22.1 C23.2 C25.2 C26.1 R17.2 R23.2 R24.2 R30.2 RX1g.1 RX2g.1 RX3g.1 RX4g.1 RX5g.1 RX6g.1 RX7g.1 RX8g.1 SIGX.2 SIGX.4 SIGX.6
NetC1x_1: C1x.1 ; port X1_Out
NetC1x_2: C1x.2 RX1A.2 RX1B.2 RX1g.2
NetC2x_1: C2x.1 ; port X2_Out
NetC2x_2: C2x.2 RX2A.2 RX2B.2 RX2g.2
NetC3x_1: C3x.1 ; port X3_Out
NetC3x_2: C3x.2 RX3A.2 RX3B.2 RX3g.2
NetC4x_1: C4x.1 ; port X4_Out
NetC4x_2: C4x.2 RX4A.2 RX4B.2 RX4g.2
NetC5x_1: C5x.1 ; port X5_Out
NetC5x_2: C5x.2 RX5A.2 RX5B.2 RX5g.2
NetC6x_1: C6x.1 ; port X6_Out
NetC6x_2: C6x.2 RX6A.2 RX6B.2 RX6g.2
NetC7x_1: C7x.1 ; port X7_Out
NetC7x_2: C7x.2 RX7A.2 RX7B.2 RX7g.2
NetC8x_1: C8x.1 ; port X8_Out
NetC8x_2: C8x.2 RX8A.2 RX8B.2 RX8g.2
NetC18_1: C18.1 R21.1 R22.2
NetC18_2: C18.2 R20.1 RXA.2 U11.7(OUT) ; port XA_m
NetC19_1: C19.1 R22.1 U11.5(IN+)
NetC24_1: C24.1 R28.1 R29.2
NetC24_2: C24.2 R27.1 RXB.2 U12.1(OUT) ; port XB_m
NetC25_1: C25.1 R29.1 U12.3(IN+)
NetR17_1: R17.1 R19.1 R20.2 U11.6(IN-)
NetR18_1: R18.1 R19.2 R21.2 U11.1(OUT)
NetR18_2: R18.2 RX1A.1 RX2A.1 RX3A.1 RX4A.1 RX5A.1 RX6A.1 RX7A.1 RX8A.1 U11.2(IN-)
NetR23_1: R23.1 U11.3(IN+)
NetR24_1: R24.1 R26.1 R27.2 U12.2(IN-)
NetR25_1: R25.1 R26.2 R28.2 U12.7(OUT)
NetR25_2: R25.2 RX1B.1 RX2B.1 RX3B.1 RX4B.1 RX5B.1 RX6B.1 RX7B.1 RX8B.1 U12.6(IN-)
NetR30_1: R30.1 U12.5(IN+)
NetRXA_1: RXA.1 SIGX.1 ; port XA
NetRXB_1: RXB.1 SIGX.7 ; port XB

### Notes on the sheet
- G= 4
  R = 560
  N = 8
  Rn = R/{ (n-1)*( (G-1)/(N-1) ) +1}
  Analog Readout System with Charge Division Type Output
  Analog_Readout_Popov.pdf
- (in symbol AD8056ARM, part A) A
- (in symbol AD8056ARM, part B) B

### Library data of the parts
C1x C2x C3x C4x C5x C6x C7x C8x C17-C20 C23-C26 = Cap: Capacitor; Published: 8-Jun-2000; LatestRevisionDate: 17-Jul-2002; LatestRevisionNote: Re-released for DXP Platform.; PackageReference: RAD-0.3; Publisher: Altium Limited; PackageDescription: Radial Cap, Thru-Hole; 2 Leads; 0.3 in Pin Spacing
C21 C22 = Cap Pol3: Polarized Capacitor (Surface Mount); Published: 8-Jun-2000; LatestRevisionDate: 29-May-2009; LatestRevisionNote: IPC-7351 Footprint Added.; PackageReference: C0805; Publisher: Altium Limited; PackageDescription: Chip Capacitor
R17-R30 RX1A RX1B RX1g RX2A RX2B RX2g RX3A RX3B RX3g RX4A RX4B RX4g RX5A RX5B RX5g RX6A RX6B RX6g RX7A RX7B RX7g RX8A RX8B RX8g RXA RXB = Res3: Resistor; Published: 8-Jun-2000; LatestRevisionDate: 29-May-2009; LatestRevisionNote: IPC-7351 Footprint Added.; PackageReference: J1-0603; Publisher: Altium Limited; PackageDescription: Chip Resistor
SIGX = Header 7: Header, 7-Pin; LatestRevisionDate: 17-Jul-2002; LatestRevisionNote: Re-released for DXP Platform.; Publisher: Altium Limited
U11 U12 = AD8056ARM: Low Cost, 300MHz Voltage Feedback Amplifier; Published: 8-Jun-2000; LatestRevisionDate: 04-Mar-2005; LatestRevisionNote: Stylized 3D Model Added, PCB footprint pad width decreased.; DatasheetVersion: REV. 0 1997; PackageVersion: 2004; PackageReference: RM-8; Publisher: Altium Limited; PackageDescription: Shrink Small Outline, MSOP; 8 Leads; Body Width 3 mm; Pitch 0.65 mm; Code_JEDEC: MO-187-AA; ComponentLink1Description: Manufacturer Link; ComponentLink1URL: http://www.analog.com/en/prod/0,,759_786_AD8055%2C00.html; ComponentLink2Description: Datasheet; ComponentLink2URL: http://www.analog.com/UploadedFiles/Data_Sheets/40402558757264AD8055_6_i.pdf

## Sheet etapa1_anger_Y.SchDoc
size A4
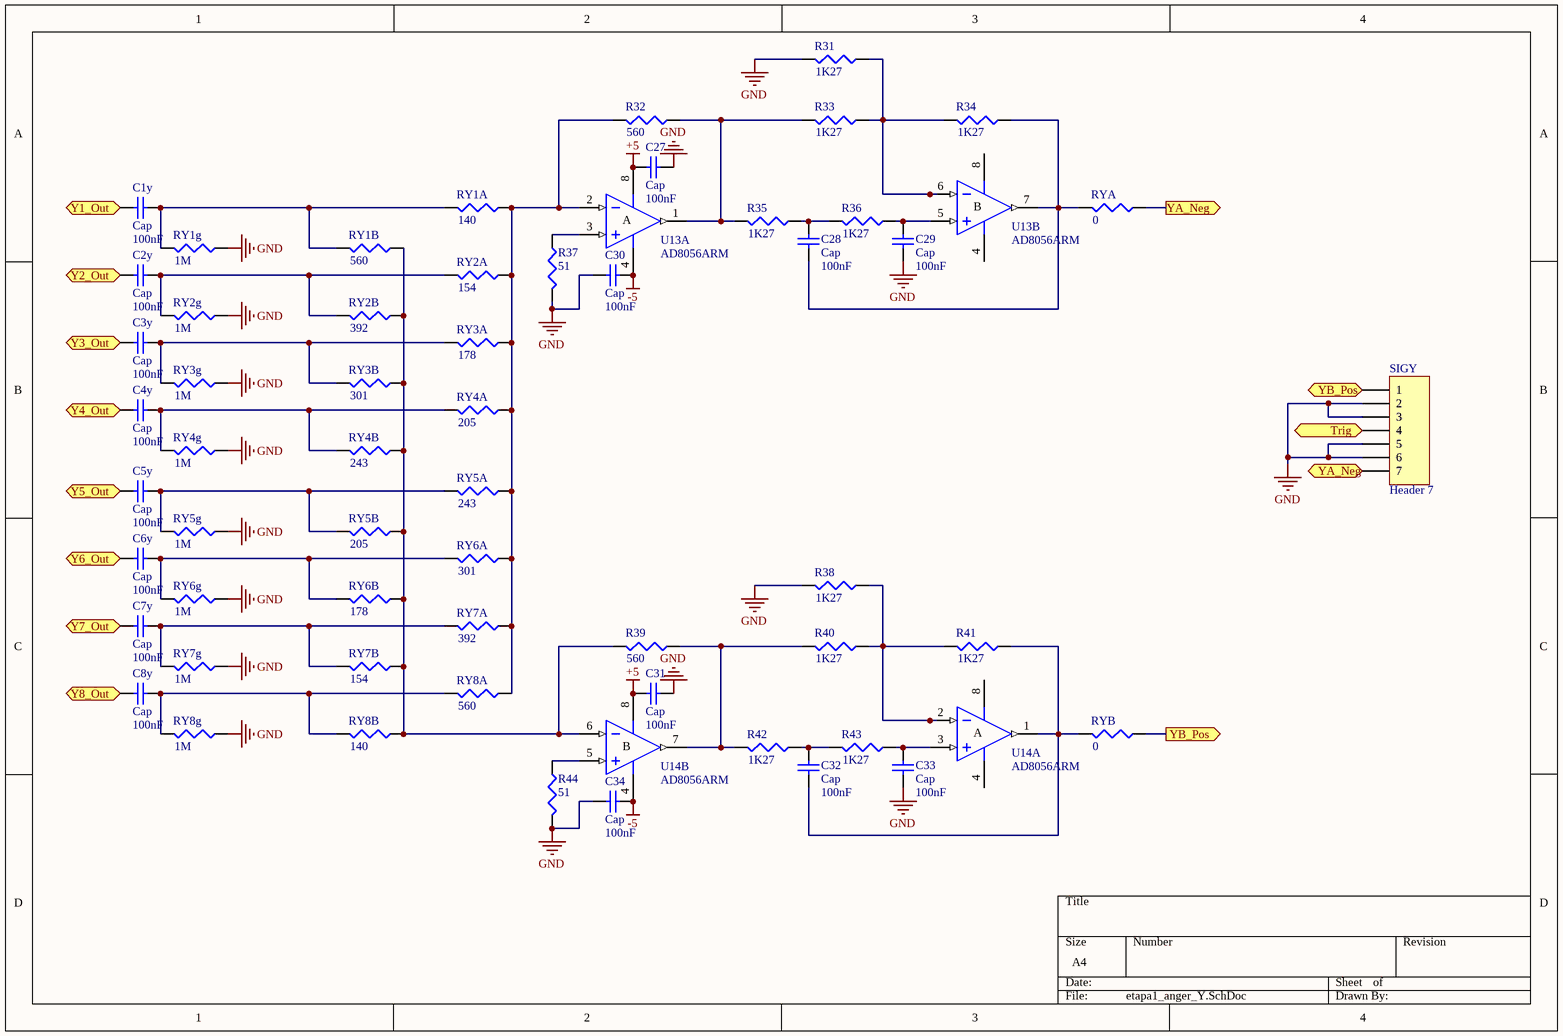
[diagram p4: etapa1_anger_Y.SchDoc]

### Parts
C1y  Cap  value 100nF  [1608[0603]]
C2y  Cap  value 100nF  [1608[0603]]
C3y  Cap  value 100nF  [1608[0603]]
C4y  Cap  value 100nF  [1608[0603]]
C5y  Cap  value 100nF  [1608[0603]]
C6y  Cap  value 100nF  [1608[0603]]
C7y  Cap  value 100nF  [1608[0603]]
C8y  Cap  value 100nF  [1608[0603]]
C27  Cap  value 100nF  [1608[0603]]
C28  Cap  value 100nF  [1608[0603]]
C29  Cap  value 100nF  [1608[0603]]
C30  Cap  value 100nF  [1608[0603]]
C31  Cap  value 100nF  [1608[0603]]
C32  Cap  value 100nF  [1608[0603]]
C33  Cap  value 100nF  [1608[0603]]
C34  Cap  value 100nF  [1608[0603]]
R31  value 1K27  [1608[0603]]  (hidden comment: Res3)
R32  value 560  [0402]  (hidden comment: Res3)
R33  value 1K27  [0402]  (hidden comment: Res3)
R34  value 1K27  [0402]  (hidden comment: Res3)
R35  value 1K27  [0402]  (hidden comment: Res3)
R36  value 1K27  [0402]  (hidden comment: Res3)
R37  value 51  [0402]  (hidden comment: Res3)
R38  value 1K27  [1608[0603]]  (hidden comment: Res3)
R39  value 560  [0402]  (hidden comment: Res3)
R40  value 1K27  [0402]  (hidden comment: Res3)
R41  value 1K27  [0402]  (hidden comment: Res3)
R42  value 1K27  [0402]  (hidden comment: Res3)
R43  value 1K27  [0402]  (hidden comment: Res3)
R44  value 51  [0402]  (hidden comment: Res3)
RY1A  value 140  [0402]  (hidden comment: Res3)
RY1B  value 560  [0402]  (hidden comment: Res3)
RY1g  value 1M  [J1-0603]  (hidden comment: Res3)
RY2A  value 154  [0402]  (hidden comment: Res3)
RY2B  value 392  [0402]  (hidden comment: Res3)
RY2g  value 1M  [J1-0603]  (hidden comment: Res3)
RY3A  value 178  [0402]  (hidden comment: Res3)
RY3B  value 301  [0402]  (hidden comment: Res3)
RY3g  value 1M  [J1-0603]  (hidden comment: Res3)
RY4A  value 205  [0402]  (hidden comment: Res3)
RY4B  value 243  [0402]  (hidden comment: Res3)
RY4g  value 1M  [J1-0603]  (hidden comment: Res3)
RY5A  value 243  [0402]  (hidden comment: Res3)
RY5B  value 205  [0402]  (hidden comment: Res3)
RY5g  value 1M  [J1-0603]  (hidden comment: Res3)
RY6A  value 301  [0402]  (hidden comment: Res3)
RY6B  value 178  [0402]  (hidden comment: Res3)
RY6g  value 1M  [J1-0603]  (hidden comment: Res3)
RY7A  value 392  [0402]  (hidden comment: Res3)
RY7B  value 154  [0402]  (hidden comment: Res3)
RY7g  value 1M  [J1-0603]  (hidden comment: Res3)
RY8A  value 560  [0402]  (hidden comment: Res3)
RY8B  value 140  [0402]  (hidden comment: Res3)
RY8g  value 1M  [J1-0603]  (hidden comment: Res3)
RYA  value 0  [0402]  (hidden comment: Res3)
RYB  value 0  [0402]  (hidden comment: Res3)
SIGY  Header 7  [HDR1X7]
U13  AD8056ARM  [RM-8]  (parts A,B of 2)
U14  AD8056ARM  [RM-8]  (parts A,B of 2)

### Ports
Trig (out), Y1_Out (out), Y2_Out (out), Y3_Out (out), Y4_Out (out), Y5_Out (out), Y6_Out (out), Y7_Out (out), Y8_Out (out), YA_Neg (out), YB_Pos (out)

### Nets
+5: C27.1 C31.1 U13.8(V+) U14.8(V+)
-5: C30.2 C34.2 U13.4(V-) U14.4(V-)
GND: C27.2 C29.2 C30.1 C31.2 C33.2 C34.1 R31.2 R37.2 R38.2 R44.2 RY1g.1 RY2g.1 RY3g.1 RY4g.1 RY5g.1 RY6g.1 RY7g.1 RY8g.1 SIGY.2 SIGY.3 SIGY.5 SIGY.6
NetC1y_1: C1y.1 ; port Y1_Out
NetC1y_2: C1y.2 RY1A.2 RY1B.2 RY1g.2
NetC2y_1: C2y.1 ; port Y2_Out
NetC2y_2: C2y.2 RY2A.2 RY2B.2 RY2g.2
NetC3y_1: C3y.1 ; port Y3_Out
NetC3y_2: C3y.2 RY3A.2 RY3B.2 RY3g.2
NetC4y_1: C4y.1 ; port Y4_Out
NetC4y_2: C4y.2 RY4A.2 RY4B.2 RY4g.2
NetC5y_1: C5y.1 ; port Y5_Out
NetC5y_2: C5y.2 RY5A.2 RY5B.2 RY5g.2
NetC6y_1: C6y.1 ; port Y6_Out
NetC6y_2: C6y.2 RY6A.2 RY6B.2 RY6g.2
NetC7y_1: C7y.1 ; port Y7_Out
NetC7y_2: C7y.2 RY7A.2 RY7B.2 RY7g.2
NetC8y_1: C8y.1 ; port Y8_Out
NetC8y_2: C8y.2 RY8A.2 RY8B.2 RY8g.2
NetC28_1: C28.1 R35.1 R36.2
NetC28_2: C28.2 R34.1 RYA.2 U13.7(OUT)
NetC29_1: C29.1 R36.1 U13.5(IN+)
NetC32_1: C32.1 R42.1 R43.2
NetC32_2: C32.2 R41.1 RYB.2 U14.1(OUT)
NetC33_1: C33.1 R43.1 U14.3(IN+)
NetR31_1: R31.1 R33.1 R34.2 U13.6(IN-)
NetR32_1: R32.1 R33.2 R35.2 U13.1(OUT)
NetR32_2: R32.2 RY1A.1 RY2A.1 RY3A.1 RY4A.1 RY5A.1 RY6A.1 RY7A.1 RY8A.1 U13.2(IN-)
NetR37_1: R37.1 U13.3(IN+)
NetR38_1: R38.1 R40.1 R41.2 U14.2(IN-)
NetR39_1: R39.1 R40.2 R42.2 U14.7(OUT)
NetR39_2: R39.2 RY1B.1 RY2B.1 RY3B.1 RY4B.1 RY5B.1 RY6B.1 RY7B.1 RY8B.1 U14.6(IN-)
NetR44_1: R44.1 U14.5(IN+)
NetRXB1_1: SIGY.4 ; port Trig
NetRYA_1: RYA.1 SIGY.7 ; port YA_Neg
NetRYB_1: RYB.1 SIGY.1 ; port YB_Pos

### Notes on the sheet
- (in symbol AD8056ARM, part A) A
- (in symbol AD8056ARM, part B) B
- (in symbol AD8056AR, part A) A
- (in symbol AD8056AR, part B) B

### Library data of the parts
C1y C2y C3y C4y C5y C6y C7y C8y C27-C34 = Cap: Capacitor; Published: 8-Jun-2000; LatestRevisionDate: 17-Jul-2002; LatestRevisionNote: Re-released for DXP Platform.; PackageReference: RAD-0.3; Publisher: Altium Limited; PackageDescription: Radial Cap, Thru-Hole; 2 Leads; 0.3 in Pin Spacing
R31-R44 RY1A RY1B RY1g RY2A RY2B RY2g RY3A RY3B RY3g RY4A RY4B RY4g RY5A RY5B RY5g RY6A RY6B RY6g RY7A RY7B RY7g RY8A RY8B RY8g RYA RYB = Res3: Resistor; Published: 8-Jun-2000; LatestRevisionDate: 29-May-2009; LatestRevisionNote: IPC-7351 Footprint Added.; PackageReference: J1-0603; Publisher: Altium Limited; PackageDescription: Chip Resistor
SIGY = Header 7: Header, 7-Pin; LatestRevisionDate: 17-Jul-2002; LatestRevisionNote: Re-released for DXP Platform.; Publisher: Altium Limited
U13 U14 = AD8056ARM: as U11 on sheet etapa1_anger_X; Published: 8-Jun-2000; LatestRevisionDate: 04-Mar-2005; LatestRevisionNote: Stylized 3D Model Added, PCB footprint pad width decreased.; DatasheetVersion: REV. 0 1997; PackageVersion: 2004; PackageReference: RM-8; Publisher: Altium Limited; PackageDescription: Shrink Small Outline, MSOP; 8 Leads; Body Width 3 mm; Pitch 0.65 mm; Code_JEDEC: MO-187-AA; ComponentLink1Description: Manufacturer Link; ComponentLink1URL: http://www.analog.com/en/prod/0,,759_786_AD8055%2C00.html; ComponentLink2Description: Datasheet; ComponentLink2URL: http://www.analog.com/UploadedFiles/Data_Sheets/40402558757264AD8055_6_i.pdf

## Nets that join several sheets
+5: etapa_1_2 (8 pins), etapa1_suma (13 pins), etapa1_anger_X (6 pins), etapa1_anger_Y (C27.1 C31.1 U13.8 U14.8)
+HV: etapa_1 (32 pins), etapa_1_2 (32 pins)
-5: etapa_1_2 (8 pins), etapa1_suma (13 pins), etapa1_anger_X (6 pins), etapa1_anger_Y (C30.2 C34.2 U13.4 U14.4)
GND: etapa_1_2 (81 pins), etapa1_suma (35 pins), etapa1_anger_X (23 pins), etapa1_anger_Y (22 pins)
NetC1x_1: etapa_1_2 (R1#2.2 U1.1), etapa1_anger_X (C1x.1)
NetC1y_1: etapa1_suma (R9.2 U5.1), etapa1_anger_Y (C1y.1)
NetC2x_1: etapa_1_2 (R2.2 U1.7), etapa1_anger_X (C2x.1)
NetC2y_1: etapa1_suma (R10.2 U5.7), etapa1_anger_Y (C2y.1)
NetC3x_1: etapa_1_2 (R3.2 U2.1), etapa1_anger_X (C3x.1)
NetC3y_1: etapa1_suma (R11.2 U6.1), etapa1_anger_Y (C3y.1)
NetC4x_1: etapa_1_2 (R4.2 U2.7), etapa1_anger_X (C4x.1)
NetC4y_1: etapa1_suma (R12.2 U6.7), etapa1_anger_Y (C4y.1)
NetC5x_1: etapa_1_2 (R5.2 U3.1), etapa1_anger_X (C5x.1)
NetC5y_1: etapa1_suma (R13.2 U7.1), etapa1_anger_Y (C5y.1)
NetC6x_1: etapa_1_2 (R6.2 U3.7), etapa1_anger_X (C6x.1)
NetC6y_1: etapa1_suma (R14.2 U7.7), etapa1_anger_Y (C6y.1)
NetC7x_1: etapa_1_2 (R7.2 U4.1), etapa1_anger_X (C7x.1)
NetC7y_1: etapa1_suma (R15.2 U8.1), etapa1_anger_Y (C7y.1)
NetC8x_1: etapa_1_2 (R8.2 U4.7), etapa1_anger_X (C8x.1)
NetC8y_1: etapa1_suma (R16.2 U8.7), etapa1_anger_Y (C8y.1)
NetC18_2: etapa1_suma (R49.1), etapa1_anger_X (C18.2 R20.1 RXA.2 U11.7)
NetC24_2: etapa1_suma (R56.1), etapa1_anger_X (C24.2 R27.1 RXB.2 U12.1)
NetR1n_2: etapa_1 (R1x.2 R1y.1 SiPM1.25), etapa_1_2 (R1n.2)
NetR1y_2: etapa_1 (8 pins), etapa1_suma (R9+.1 R9-.1)
NetR2_1: etapa_1 (8 pins), etapa_1_2 (R2.1 U1.6)
NetR2n_2: etapa_1 (R2x.2 R2y.2 SiPM1.24), etapa_1_2 (R2n.2)
NetR2y_1: etapa_1 (8 pins), etapa1_suma (R10+.1 R10-.1)
NetR3_1: etapa_1 (8 pins), etapa_1_2 (R3.1 U2.2)
NetR3n_2: etapa_1 (R3x.2 R3y.2 SiPM1.17), etapa_1_2 (R3n.2)
NetR3y_1: etapa_1 (8 pins), etapa1_suma (R11+.1 R11-.1)
NetR4_1: etapa_1 (8 pins), etapa_1_2 (R4.1 U2.6)
NetR4n_2: etapa_1 (R4x.2 R4y.2 SiPM1.16), etapa_1_2 (R4n.2)
NetR4y_1: etapa_1 (8 pins), etapa1_suma (R12+.1 R12-.1)
NetR5_1: etapa_1 (8 pins), etapa_1_2 (R5.1 U3.2)
NetR5n_2: etapa_1 (R5x.2 R5y.2 SiPM2.25), etapa_1_2 (R5n.2)
NetR5y_1: etapa_1 (8 pins), etapa1_suma (R13+.1 R13-.1)
NetR6_1: etapa_1 (8 pins), etapa_1_2 (R6.1 U3.6)
NetR6n_2: etapa_1 (R6x.2 R6y.2 SiPM2.24), etapa_1_2 (R6n.2)
NetR6y_1: etapa_1 (8 pins), etapa1_suma (R14+.1 R14-.1)
NetR7_1: etapa_1 (8 pins), etapa_1_2 (R7.1 U4.2)
NetR7n_2: etapa_1 (R7x.2 R7y.2 SiPM2.17), etapa_1_2 (R7n.2)
NetR7y_1: etapa_1 (8 pins), etapa1_suma (R15+.1 R15-.1)
NetR8_1: etapa_1 (8 pins), etapa_1_2 (R8.1 U4.6)
NetR8n_2: etapa_1 (R8x.2 R8y.2 SiPM2.16), etapa_1_2 (R8n.2)
NetR8y_1: etapa_1 (8 pins), etapa1_suma (R16+.1 R16-.1)
NetR9n_2: etapa_1 (R9x.2 R9y.2 SiPM1.26), etapa_1_2 (R9n.2)
NetR10n_2: etapa_1 (R10x.2 R10y.2 SiPM1.27), etapa_1_2 (R10n.2)
NetR11n_2: etapa_1 (R11x.2 R11y.2 SiPM1.14), etapa_1_2 (R11n.2)
NetR12n_2: etapa_1 (R12x.2 R12y.2 SiPM1.15), etapa_1_2 (R12n.2)
NetR13n_2: etapa_1 (R13x.2 R13y.2 SiPM2.26), etapa_1_2 (R13n.2)
NetR14n_2: etapa_1 (R14x.2 R14y.2 SiPM2.27), etapa_1_2 (R14n.2)
NetR15n_2: etapa_1 (R15x.2 R15y.2 SiPM2.14), etapa_1_2 (R15n.2)
NetR16n_2: etapa_1 (R16x.2 R16y.2 SiPM2.15), etapa_1_2 (R16n.2)
NetR17n_2: etapa_1 (R17x.2 R17y.2 SiPM1.35), etapa_1_2 (R17n.2)
NetR18n_2: etapa_1 (R18x.2 R18y.2 SiPM1.34), etapa_1_2 (R18n.2)
NetR19n_2: etapa_1 (R19x.2 R19y.2 SiPM1.7), etapa_1_2 (R19n.2)
NetR20n_2: etapa_1 (R20x.2 R20y.2 SiPM1.6), etapa_1_2 (R20n.2)
NetR21n_2: etapa_1 (R21x.2 R21y.2 SiPM2.35), etapa_1_2 (R21n.2)
NetR22n_2: etapa_1 (R22x.2 R22y.2 SiPM2.34), etapa_1_2 (R22n.2)
NetR23n_2: etapa_1 (R23x.2 R23y.2 SiPM2.7), etapa_1_2 (R23n.2)
NetR24n_2: etapa_1 (R24x.2 R24y.2 SiPM2.6), etapa_1_2 (R24n.2)
NetR25n_2: etapa_1 (R25x.2 R25y.2 SiPM1.36), etapa_1_2 (R25n.2)
NetR26n_2: etapa_1 (R26x.2 R26y.2 SiPM1.37), etapa_1_2 (R26n.2)
NetR27n_2: etapa_1 (R27x.2 R27y.2 SiPM1.4), etapa_1_2 (R27n.2)
NetR28n_2: etapa_1 (R28x.2 R28y.2 SiPM1.5), etapa_1_2 (R28n.2)
NetR29n_2: etapa_1 (R29x.2 R29y.2 SiPM2.36), etapa_1_2 (R29n.2)
NetR30n_2: etapa_1 (R30x.2 R30y.2 SiPM2.37), etapa_1_2 (R30n.2)
NetR31n_2: etapa_1 (R31x.2 R31y.2 SiPM2.4), etapa_1_2 (R31n.2)
NetR32n_2: etapa_1 (R32x.2 R32y.2 SiPM2.5), etapa_1_2 (R32n.2)
NetR33n_2: etapa_1 (R33x.2 R33y.2), etapa_1_2 (R33n.2 SiPM3.25)
NetR34n_2: etapa_1 (R34x.2 R34y.2), etapa_1_2 (R34n.2 SiPM3.24)
NetR35n_2: etapa_1 (R35x.2 R35y.2), etapa_1_2 (R35n.2 SiPM3.17)
NetR36n_2: etapa_1 (R36x.2 R36y.2), etapa_1_2 (R36n.2 SiPM3.16)
NetR37n_2: etapa_1 (R37x.2 R37y.2), etapa_1_2 (R37n.2 SiPM4.25)
NetR38n_2: etapa_1 (R38x.2 R38y.2), etapa_1_2 (R38n.2 SiPM4.24)
NetR39n_2: etapa_1 (R39x.2 R39y.2), etapa_1_2 (R39n.2 SiPM4.17)
NetR40n_2: etapa_1 (R40x.2 R40y.2), etapa_1_2 (R40n.2 SiPM4.16)
NetR41n_2: etapa_1 (R41x.2 R41y.2), etapa_1_2 (R41n.2 SiPM3.26)
NetR42n_2: etapa_1 (R42x.2 R42y.2), etapa_1_2 (R42n.2 SiPM3.27)
NetR43n_2: etapa_1 (R43x.2 R43y.2), etapa_1_2 (R43n.2 SiPM3.14)
NetR44n_2: etapa_1 (R44x.2 R44y.2), etapa_1_2 (R44n.2 SiPM3.15)
NetR45n_2: etapa_1 (R45x.2 R45y.2), etapa_1_2 (R45n.2 SiPM4.26)
NetR46n_2: etapa_1 (R46x.2 R46y.2), etapa_1_2 (R46n.2 SiPM4.27)
NetR47n_2: etapa_1 (R47x.2 R47y.2), etapa_1_2 (R47n.2 SiPM4.14)
NetR48n_2: etapa_1 (R48x.2 R48y.2), etapa_1_2 (R48n.2 SiPM4.15)
NetR49n_2: etapa_1 (R49x.2 R49y.2), etapa_1_2 (R49n.2 SiPM3.35)
NetR50n_2: etapa_1 (R50x.2 R50y.2), etapa_1_2 (R50n.2 SiPM3.34)
NetR51n_2: etapa_1 (R51x.2 R51y.2), etapa_1_2 (R51n.2 SiPM3.7)
NetR52n_2: etapa_1 (R52x.2 R52y.2), etapa_1_2 (R52n.2 SiPM3.6)
NetR53n_2: etapa_1 (R53x.2 R53y.2), etapa_1_2 (R53n.2 SiPM4.35)
NetR54n_2: etapa_1 (R54x.2 R54y.2), etapa_1_2 (R54n.2 SiPM4.34)
NetR55n_2: etapa_1 (R55x.2 R55y.2), etapa_1_2 (R55n.2 SiPM4.7)
NetR56n_2: etapa_1 (R56x.2 R56y.2), etapa_1_2 (R56n.2 SiPM4.6)
NetR57n_2: etapa_1 (R57x.2 R57y.2), etapa_1_2 (R57n.2 SiPM3.36)
NetR58n_2: etapa_1 (R58x.2 R58y.2), etapa_1_2 (R58n.2 SiPM3.37)
NetR59n_2: etapa_1 (R59x.2 R59y.2), etapa_1_2 (R59n.2 SiPM3.4)
NetR60n_2: etapa_1 (R60x.2 R60y.2), etapa_1_2 (R60n.2 SiPM3.5)
NetR61n_2: etapa_1 (R61x.2 R61y.2), etapa_1_2 (R61n.2 SiPM4.36)
NetR62n_2: etapa_1 (R62x.2 R62y.2), etapa_1_2 (R62n.2 SiPM4.37)
NetR63n_2: etapa_1 (R63x.2 R63y.2), etapa_1_2 (R63n.2 SiPM4.5)
NetR64n_2: etapa_1 (R64x.2 R64y.2), etapa_1_2 (R64n.2 SiPM4.4)
NetRXB1_1: etapa1_suma (RXB1.1), etapa1_anger_Y (SIGY.4)
NetSiPM1_28: etapa_1 (SiPM1.28 SiPM2.28), etapa_1_2 (SiPM3.28 SiPM4.28)
NetSiPM1_33: etapa_1 (SiPM1.33 SiPM2.33), etapa_1_2 (SiPM3.33 SiPM4.33)
NetSiPM1_38: etapa_1 (SiPM1.38 SiPM2.38), etapa_1_2 (SiPM3.38 SiPM4.38)